# Altium schematic sheet F4FlightController.SchDoc
size A4
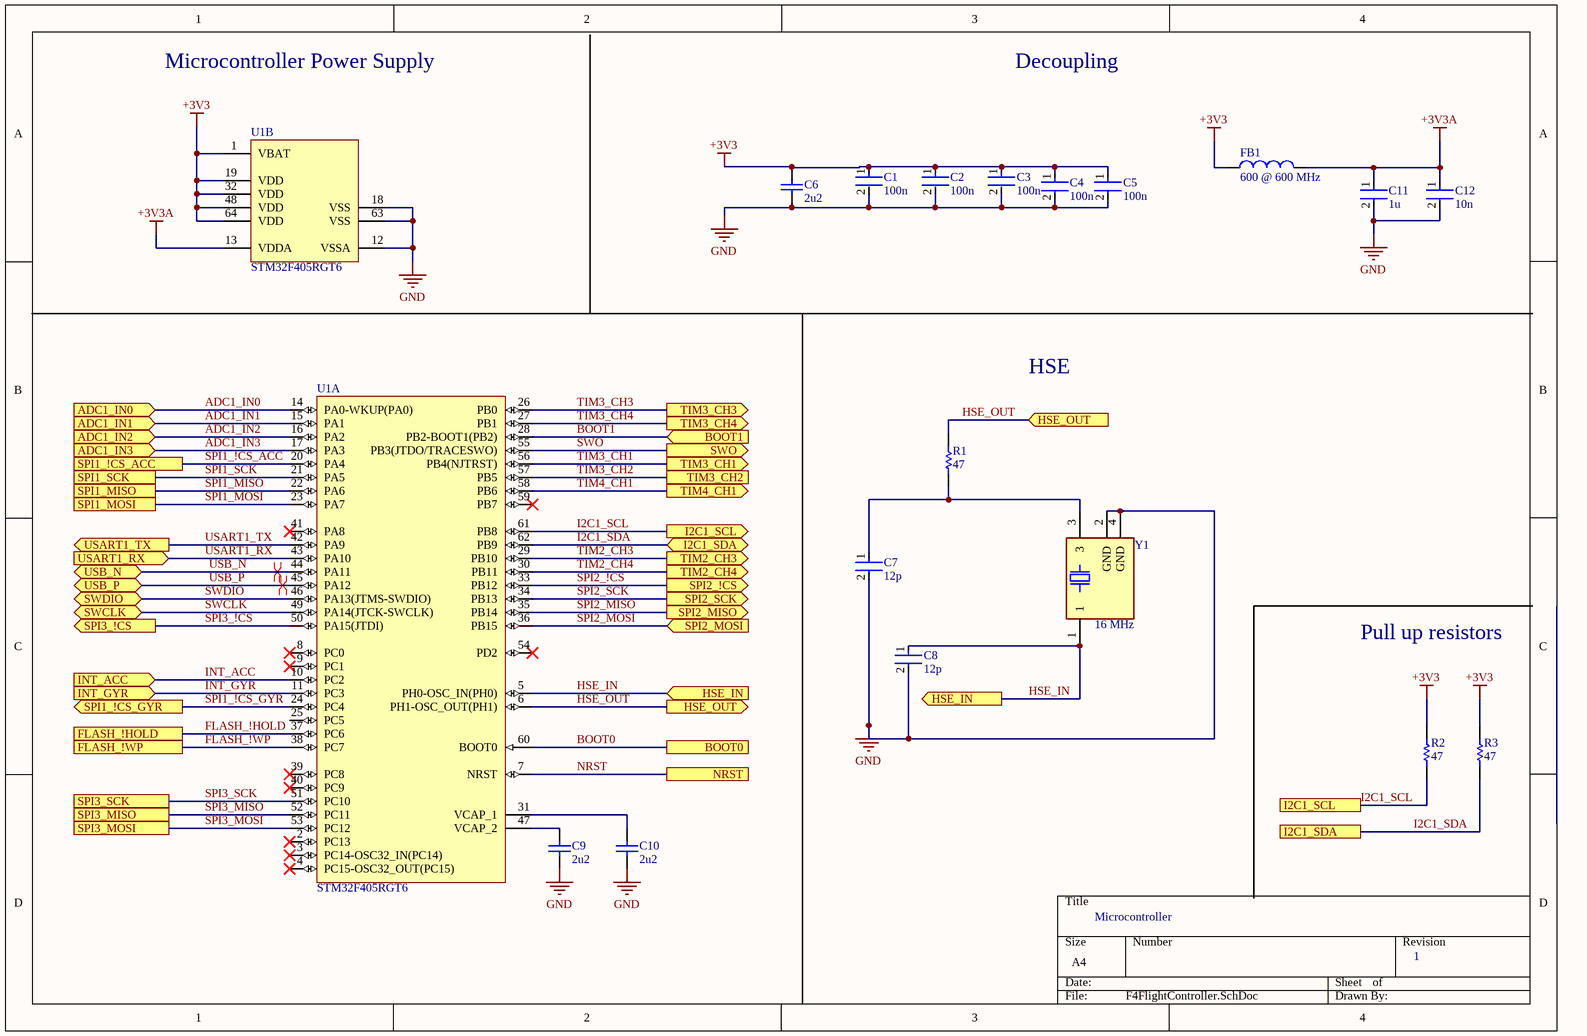
[diagram p0: F4FlightController.SchDoc]

## Parts
C1  100n  [Capacitor 0402]
C2  100n  [Capacitor 0402]
C3  100n  [Capacitor 0402]
C4  100n  [Capacitor 0402]
C5  100n  [Capacitor 0402]
C6  2u2  [CAPACITOR 0603]
C7  12p  [Capacitor 0402]
C8  12p  [Capacitor 0402]
C9  2u2  [CAPACITOR 0603]
C10  2u2  [CAPACITOR 0603]
C11  1u  [Capacitor 0402]
C12  10n  [Capacitor 0402]
FB1  600 @ 600 MHz  [Inductor 0805]
R1  47  [Resistor 0402]
R2  47  [Resistor 0402]
R3  47  [Resistor 0402]
U1  STM32F405RGT6  [STM-LQFP64_M]  (parts A,B of 2)
Y1  16 MHz  [XTAL_TSX-3225_16.0000MF18X-AC3]

## Ports
ADC1_IN0 (in), ADC1_IN1 (in), ADC1_IN2 (in), ADC1_IN3 (in), BOOT0, BOOT1 (in), FLASH_!HOLD, FLASH_!WP, HSE_IN (in), HSE_IN (out), HSE_OUT (in), HSE_OUT (out), I2C1_SCL, I2C1_SCL (out), I2C1_SDA, I2C1_SDA (bidir), INT_ACC (in), INT_GYR (in), NRST, SPI1_!CS_ACC, SPI1_!CS_GYR (out), SPI1_MISO, SPI1_MOSI, SPI1_SCK, SPI2_!CS (out), SPI2_MISO (out), SPI2_MOSI (in), SPI2_SCK (out), SPI3_!CS (out), SPI3_MISO, SPI3_MOSI, SPI3_SCK, SWCLK (bidir), SWDIO (bidir), SWO (out), TIM2_CH3 (out), TIM2_CH4 (out), TIM3_CH1 (out), TIM3_CH2, TIM3_CH3 (out), TIM3_CH4 (out), TIM4_CH1 (out), USART1_RX (in), USART1_TX (out), USB_N (bidir), USB_P (bidir)

## Nets
+3V3: C1.1 C2.1 C3.1 C4.1 C5.1 C6.2 FB1.1 R2.2 R3.2 U1.1(VBAT) U1.19(VDD) U1.32(VDD) U1.48(VDD) U1.64(VDD)
+3V3A: C11.1 C12.1 FB1.2 U1.13(VDDA)
GND: C1.2 C2.2 C3.2 C4.2 C5.2 C6.1 C7.2 C8.2 C9.1 C10.1 C11.2 C12.2 U1.12(VSSA) U1.18(VSS) U1.63(VSS) Y1.2(GND) Y1.4(GND)
ADC1_IN0: U1.14(PA0-WKUP(PA0)) ; port ADC1_IN0
ADC1_IN1: U1.15(PA1) ; port ADC1_IN1
ADC1_IN2: U1.16(PA2) ; port ADC1_IN2
ADC1_IN3: U1.17(PA3) ; port ADC1_IN3
BOOT0: U1.60(BOOT0) ; port BOOT0
BOOT1: U1.28(PB2-BOOT1(PB2)) ; port BOOT1
FLASH_!HOLD: U1.37(PC6) ; port FLASH_!HOLD
FLASH_!WP: U1.38(PC7) ; port FLASH_!WP
HSE_IN: C8.1 U1.5(PH0-OSC_IN(PH0)) Y1.1 ; port HSE_IN
HSE_OUT: R1.2 U1.6(PH1-OSC_OUT(PH1)) ; port HSE_OUT
I2C1_SCL: R2.1 U1.61(PB8) ; port I2C1_SCL
I2C1_SDA: R3.1 U1.62(PB9) ; port I2C1_SDA
INT_ACC: U1.10(PC2) ; port INT_ACC
INT_GYR: U1.11(PC3) ; port INT_GYR
NRST: U1.7(NRST) ; port NRST
SPI1_!CS_ACC: U1.20(PA4) ; port SPI1_!CS_ACC
SPI1_!CS_GYR: U1.24(PC4) ; port SPI1_!CS_GYR
SPI1_MISO: U1.22(PA6) ; port SPI1_MISO
SPI1_MOSI: U1.23(PA7) ; port SPI1_MOSI
SPI1_SCK: U1.21(PA5) ; port SPI1_SCK
SPI2_!CS: U1.33(PB12) ; port SPI2_!CS
SPI2_MISO: U1.35(PB14) ; port SPI2_MISO
SPI2_MOSI: U1.36(PB15) ; port SPI2_MOSI
SPI2_SCK: U1.34(PB13) ; port SPI2_SCK
SPI3_!CS: U1.50(PA15(JTDI)) ; port SPI3_!CS
SPI3_MISO: U1.52(PC11) ; port SPI3_MISO
SPI3_MOSI: U1.53(PC12) ; port SPI3_MOSI
SPI3_SCK: U1.51(PC10) ; port SPI3_SCK
SWCLK: U1.49(PA14(JTCK-SWCLK)) ; port SWCLK
SWDIO: U1.46(PA13(JTMS-SWDIO)) ; port SWDIO
SWO: U1.55(PB3(JTDO/TRACESWO)) ; port SWO
TIM2_CH3: U1.29(PB10) ; port TIM2_CH3
TIM2_CH4: U1.30(PB11) ; port TIM2_CH4
TIM3_CH1: U1.56(PB4(NJTRST)) ; port TIM3_CH1
TIM3_CH2: U1.57(PB5) ; port TIM3_CH2
TIM3_CH3: U1.26(PB0) ; port TIM3_CH3
TIM3_CH4: U1.27(PB1) ; port TIM3_CH4
TIM4_CH1: U1.58(PB6) ; port TIM4_CH1
USART1_RX: U1.43(PA10) ; port USART1_RX
USART1_TX: U1.42(PA9) ; port USART1_TX
USB_N: U1.44(PA11) ; port USB_N
USB_P: U1.45(PA12) ; port USB_P
NetC7_1: C7.1 R1.1 Y1.3
NetC9_2: C9.2 U1.47(VCAP_2)
NetC10_2: C10.2 U1.31(VCAP_1)

Not connected (* = marked no-connect by the designer): U1 2(PC13)* 3(PC14-OSC32_IN(PC14))* 4(PC15-OSC32_OUT(PC15))* 8(PC0)* 9(PC1)* 25(PC5) 39(PC8)* 40(PC9)* 41(PA8)* 54(PD2)* 59(PB7)*

## Layout directives
differential pair: USB_N, USB_P

## Notes on the sheet
- Microcontroller Power Supply
- Decoupling
- HSE
- Pull up resistors
- Microcontroller
- 1

## Library data of the parts
C1-C5 = Capacitor 0402: Chip Capacitor 0402; Manufacturer Part Number: CC0402KRX7R7BB103; Manufacturer: YAGEO; Automotive Grade: NA; Capacitance: 10 nF; Material: Ceramic; Value: 10 nF; Tolerance: 0.1; Temperature Characteristic: X7R; Voltage Rating: 16 V; Temperature Coefficient: 30ppm/°C; Temperature Range Low: -55°C; Temperature Range High: +125°C; Mouser Description: 0402 10 nF 16 V ±10 % Tolerance X7R SMT Multilayer Ceramic Capacitor; Footprint Url: http://www.yageo.com/exep/pages/download/literatures/UPY-C_GEN_24.pdf; Category: Cap; RoHS: TRUE; ComponentLink2Description: Datasheet; Ipc Land Pattern Name: CAPC10050X50; Automotive: No; ComponentLink2URL: http://www.yageo.com/documents/recent/UPY-GP_NP0_16V-to-50V_16.pdf; Device Class L1: Passive Components; Height: 0.55mm; Package: CC0402; Device Class L3: Ceramic Capacitors; Lead Free: Yes; Device Class L2: Capacitors; Digikey Description: CAP CER 10000PF 16V X7R 0402; Octopart: https://octopart.com/cc0402krx7r7bb103-yageo-192895; Temperature: -55°C to +125°C; Manufacturer: Yageo
C6 = Chip Capacitor 0603: Chip Capacitor, 22 pF, +/- 5%, 50 V, -55 to 125 degC, 0603 (1608 Metric), RoHS, Tape and Reel; Manufacturer: Murata; Manufacturer Part Number: GRM1885C1H220JA01D; Capacitance: 22pF; Rated Voltage: 50V; Dielectric: C0G; Manufacturer URL: http://www.murata.com/; Datasheet Version: Jul-06; Package Reference: 603; Tolerance (%): ±5%; Case Size/Dimension: 0603; Package Description: 2-Pin Surface Mount Device, Body 1.6 x 0.8 mm; Datasheet URL: https://datasheet.ciiva.com/11786/0900766b807a1cab-11786398.pdf
C7 C8 C11 C12 = Capacitor 0402: Chip Capacitor 0402; Manufacturer Part Number: CC0402KRX7R7BB103; Manufacturer: Yageo; Automotive Grade: NA; Capacitance: 10 nF; Material: Ceramic; Value: 10 nF; Tolerance: 0.1; Temperature Characteristic: X7R; Voltage Rating: 16 V; Temperature Coefficient: 30ppm/°C; Temperature Range Low: -55°C; Temperature Range High: +125°C; Mouser Description: 0402 10 nF 16 V ±10 % Tolerance X7R SMT Multilayer Ceramic Capacitor; Footprint Url: http://www.yageo.com/exep/pages/download/literatures/UPY-C_GEN_24.pdf; Category: Cap; RoHS: TRUE; ComponentLink2Description: Datasheet; Ipc Land Pattern Name: CAPC10050X50; Automotive: No; ComponentLink2URL: http://www.yageo.com/documents/recent/UPY-GP_NP0_16V-to-50V_16.pdf; Device Class L1: Passive Components; Height: 0.55mm; Package: CC0402; Device Class L3: Ceramic Capacitors; Lead Free: Yes; Device Class L2: Capacitors; Digikey Description: CAP CER 10000PF 16V X7R 0402; Octopart: https://octopart.com/cc0402krx7r7bb103-yageo-192895; Temperature: -55°C to +125°C
C9 C10 = Capacitor 0603: Chip Capacitor, 22 pF, +/- 5%, 50 V, -55 to 125 degC, 0603 (1608 Metric), RoHS, Tape and Reel; Manufacturer: Murata; Manufacturer Part Number: GRM1885C1H220JA01D; Capacitance: 22pF; Rated Voltage: 50V; Dielectric: C0G; Manufacturer URL: http://www.murata.com/; Datasheet Version: Jul-06; Package Reference: 603; Tolerance (%): ±5%; Case Size/Dimension: 0603; Package Description: 2-Pin Surface Mount Device, Body 1.6 x 0.8 mm; Datasheet URL: https://datasheet.ciiva.com/11786/0900766b807a1cab-11786398.pdf
FB1 = Ferrite Bead: Ferrite Bead Murata BLM21AG601SN1D; Manufacturer: TDK; Manufacturer Part Number: MLZ2012A1R0MT000; Tolerance (%): 20%; DC Resistance: 0.6; Inductance-Nom: 10H; Rated Current-Max: 100mA; Package Reference: IND0805; Case Size/Dimension: 0805; Manufacturer URL: http://www.murata.com/; Package Description: 2-Pin Surface Mount Device, Body 2 x 1.25 mm; Datasheet URL: http://psearch.en.murata.com/inductor/product/LQM21FN100M70%23.pdf; Mounting Technology: SurfaceMount; Datasheet Version: 05/2016
R1-R3 = Resistor 0402: Chip Resistor 0402; Manufacturer: Vishay; Part Number: CRCW0402120RFKED; Manufacturer Part Number: CRCW0402120RFKED
U1 = STM32 ARM Cortex-M4: ARM Cortex-M4 32-bit MCU+FPU, 210 DMIPS, 1024 kB Flash, 192 kB Internal RAM, 51 I/Os, 64-pin LQFP, -40 to 85 degC, Tray; Manufacturer: STMicroelectronics; Supply Voltage(Vcc) min (V): 1.8; Supply Voltage(Vcc) max (V): 3.6; Internal RAM Size (kB): 192; I/Os (High Current): 51; D/A Converter: 2x12-bit; FLASH Size (Prog) (kB): 1024; Operating Frequency(F) (Processor speed) (MHz): 168; ComponentLink2Description: Datasheet; PackageVersion: Rev. 4, 06/2013; DatasheetVersion: Rev. 4; Core: ARM Cortex-M4; ComponentLink2URL: http://www.st.com/st-web-ui/static/active/en/resource/technical/document/datasheet/DM00037051.pdf; PackageReference: LQFP64; Packing: Tray; ComponentLink1Description: Manufacturer URL; ComponentLink3URL: http://www.st.com/st-web-ui/static/active/en/resource/technical/document/datasheet/DM00037051.pdf; ComponentLink3Description: Package Specification; Mounting Technology: Surface Mount; ComponentLink1URL: http://www.st.com/web/en/home.html; PackageDescription: 64-Pin Low Profile Quad Flat Package, 10 x 10 mm Body, 0.5 mm Pitch; PartNumber: STM32F405RGT6; Manufacturer Part Number: STM32F405RGT6
Y1 = TSX-3225_16.0000MF18X-AC3: 16MHz Â±10ppm Crystal 9pF 60 Ohms 4-SMD, No Lead; MP: TSX-3225 16.0000MF18X-AC3; MF: EPSON; Availability: Unavailable; Package: SMD-4 Epson; SnapEDA_Link: https://www.snapeda.com/parts/TSX-3225%2016.0000MF18X-AC3/EPSON/view-part/105674/?ref=snap; Value: *; Price: None